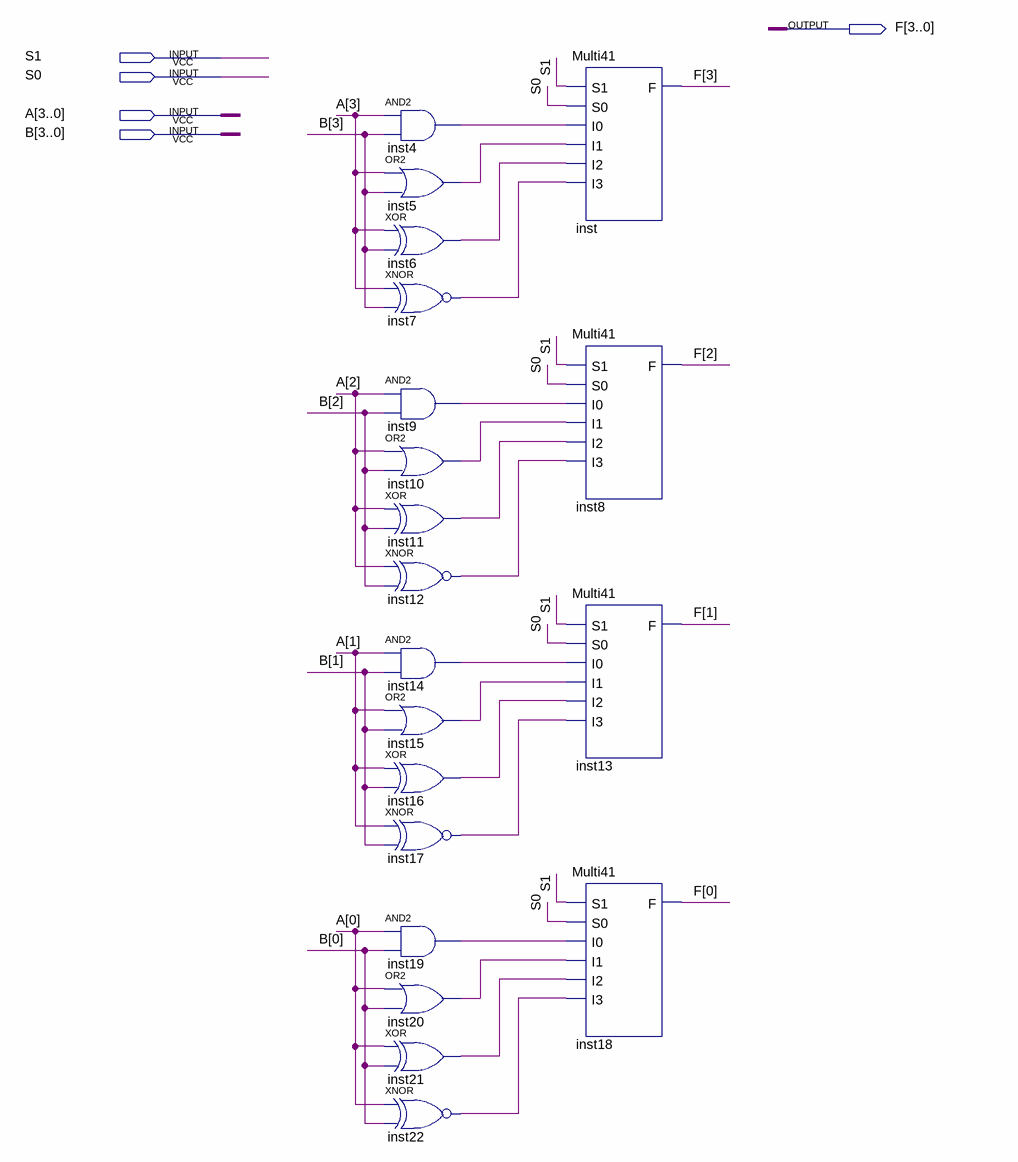
[diagram p0: schematic sheet]
// Quartus schematic LogicUnit.bdf as structural Verilog: 20 symbols, 5 pins
module LogicUnit (
  input  S1,
  input  S0,
  input  [3:0] A,
  input  [3:0] B,
  output [3:0] F
);

  wire inst4_out, inst5_out, inst6_out, inst7_out, inst9_out, inst10_out, inst11_out, inst12_out, inst14_out,
       inst15_out, inst16_out, inst17_out, inst19_out, inst20_out, inst21_out, inst22_out;

  and inst4 (inst4_out, A[3], B[3]);
  or inst5 (inst5_out, A[3], B[3]);
  xor inst6 (inst6_out, A[3], B[3]);
  xnor inst7 (inst7_out, A[3], B[3]);
  and inst9 (inst9_out, A[2], B[2]);
  or inst10 (inst10_out, A[2], B[2]);
  xor inst11 (inst11_out, A[2], B[2]);
  xnor inst12 (inst12_out, A[2], B[2]);
  and inst14 (inst14_out, A[1], B[1]);
  or inst15 (inst15_out, A[1], B[1]);
  xor inst16 (inst16_out, A[1], B[1]);
  xnor inst17 (inst17_out, A[1], B[1]);
  and inst19 (inst19_out, A[0], B[0]);
  or inst20 (inst20_out, A[0], B[0]);
  xor inst21 (inst21_out, A[0], B[0]);
  xnor inst22 (inst22_out, A[0], B[0]);
  Multi41 inst (.S1(S1), .S0(S0), .I0(inst4_out), .I1(inst5_out), .I2(inst6_out), .I3(inst7_out), .F(F[3]));
  Multi41 inst8 (.S1(S1), .S0(S0), .I0(inst9_out), .I1(inst10_out), .I2(inst11_out), .I3(inst12_out), .F(F[2]));
  Multi41 inst13 (.S1(S1), .S0(S0), .I0(inst14_out), .I1(inst15_out), .I2(inst16_out), .I3(inst17_out), .F(F[1]));
  Multi41 inst18 (.S1(S1), .S0(S0), .I0(inst19_out), .I1(inst20_out), .I2(inst21_out), .I3(inst22_out), .F(F[0]));
endmodule
